# EAGLE schematic Controlador PID Analogico (EAGLE 7.6.0)
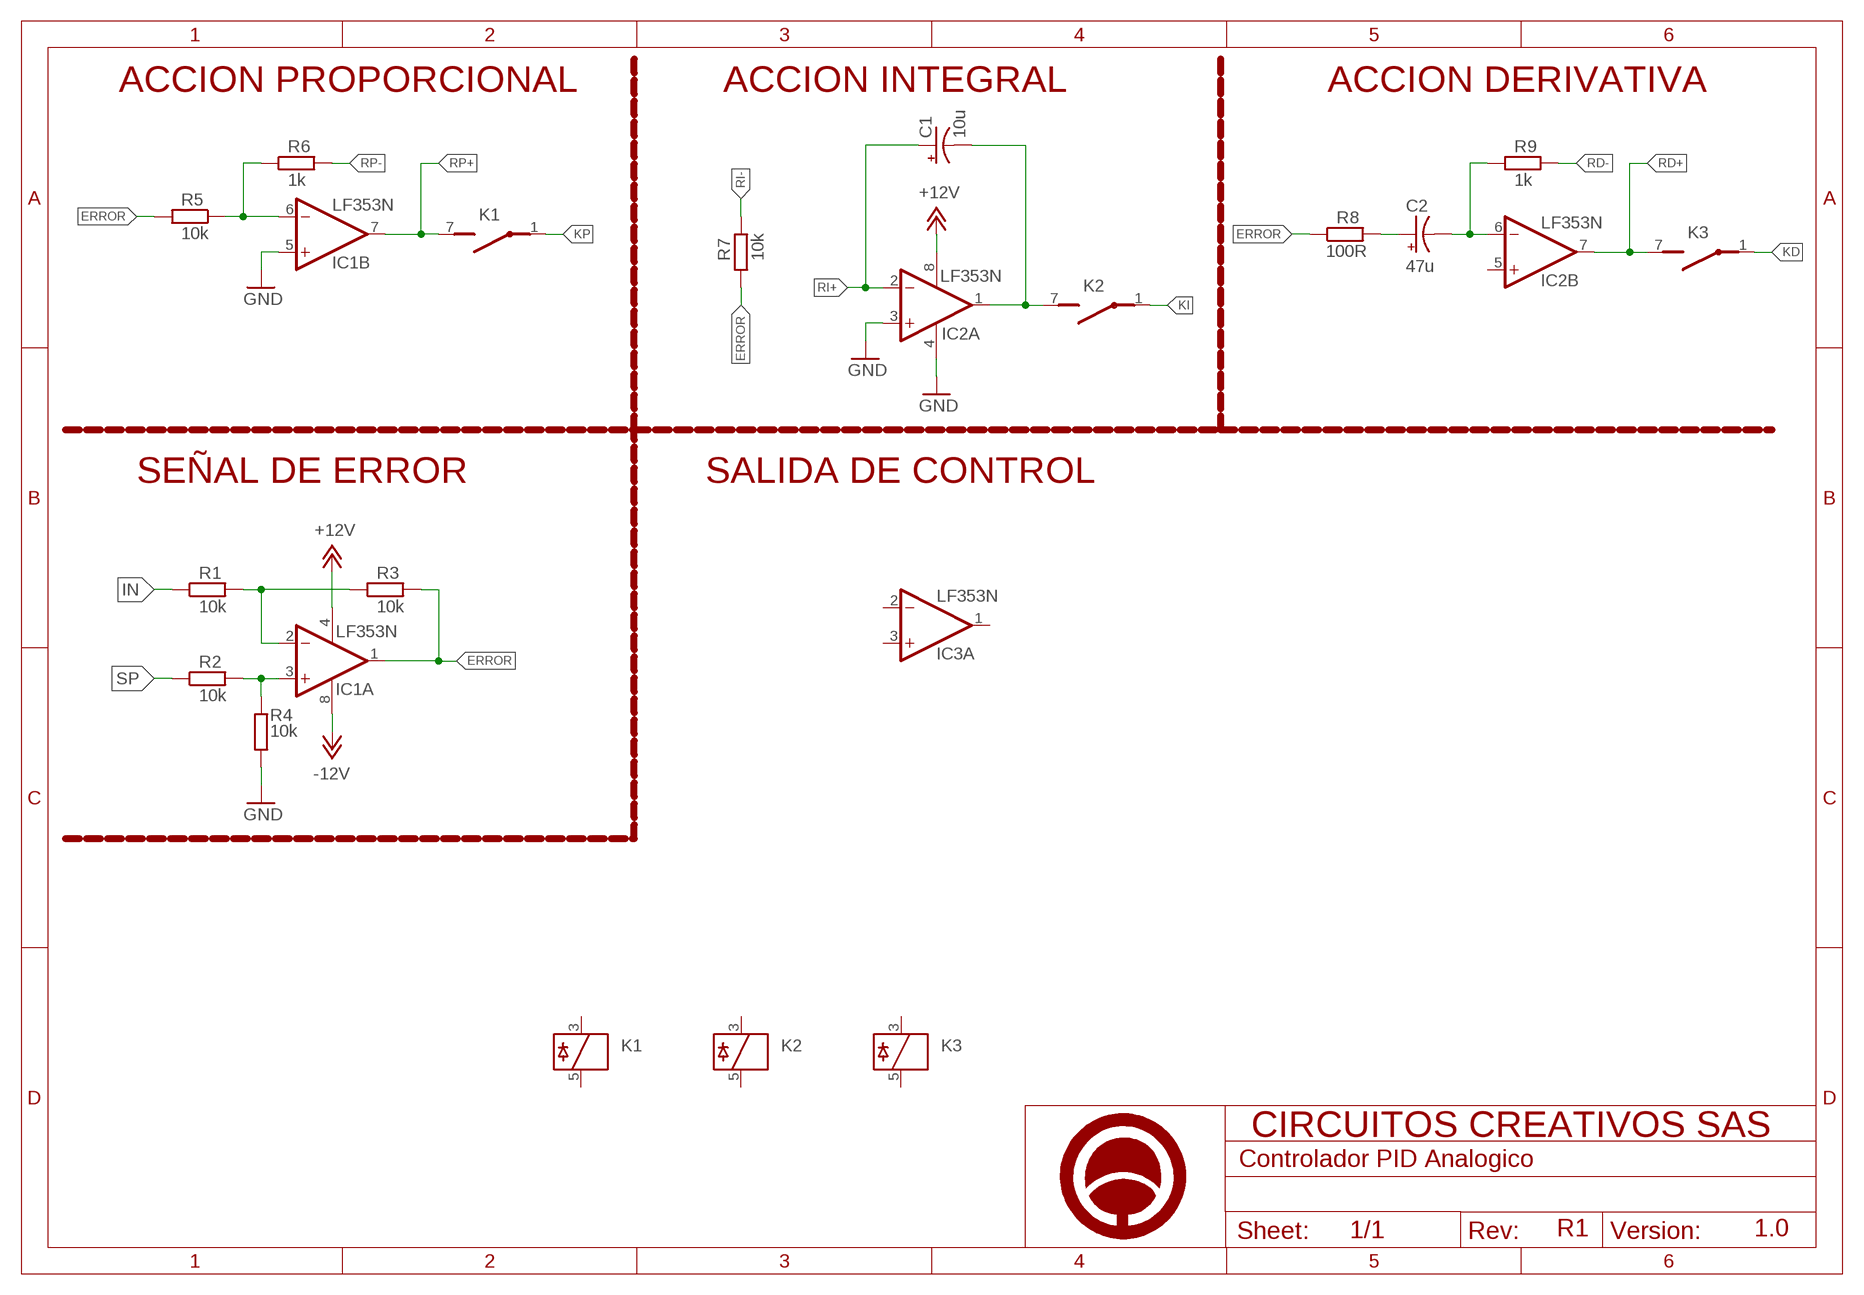
[diagram p0: schematic, sheet 1]

## Parts
C1  10u  CPOL-USE2,5-6E  [E2,5-6E]
C2  47u  CPOL-USE2,5-6E  [E2,5-6E]
IC1  LF353N  [DIL08]
IC2  LF353N  [DIL08]
IC3  LF353N  [DIL08]
K1  35701331  [REED]
K2  35701331  [REED]
K3  35701331  [REED]
R1  10k  R-EU_0204/7  [0204/7]
R2  10k  R-EU_0204/7  [0204/7]
R3  10k  R-EU_0204/7  [0204/7]
R4  10k  R-EU_0204/7  [0204/7]
R5  10k  R-EU_0204/7  [0204/7]
R6  1k  R-EU_0204/7  [0204/7]
R7  10k  R-EU_0204/7  [0204/7]
R8  100R  R-EU_0204/7  [0204/7]
R9  1k  R-EU_0204/7  [0204/7]
U$1  A4_HORIZONTAL  [LOGO]

## Nets
+12V: IC1.4(P:V-) IC2.8(P:V+)
-12V: IC1.8(P:V+)
ERROR: IC1.1(A:OUT) R3.2 R5.2 R7.2 R8.1
GND: IC1.5(B:+IN) IC2.3(A:+IN) IC2.4(P:V-) R4.2
IN: R1.1
KD: K3.1(2:P)
KI: K2.1(2:P)
KP: K1.1(2:P)
N$1: IC1.2(A:-IN) R1.2 R3.1
N$2: IC1.3(A:+IN) R2.2 R4.1
N$3: IC1.6(B:-IN) R5.1 R6.1
N$4: C1.- IC2.1(A:OUT) K2.7(2:S)
N$5: C2.- IC2.6(B:-IN) R9.1
N$6: C2.+ R8.2
RD+: IC2.7(B:OUT) K3.7(2:S)
RD-: R9.2
RI+: C1.+ IC2.2(A:-IN)
RI-: R7.1
RP+: IC1.7(B:OUT) K1.7(2:S)
RP-: R6.2
SP: R2.1
Unconnected: IC2.5(B:+IN) IC3.1(A:OUT) IC3.2(A:-IN) IC3.3(A:+IN) IC3.5(B:+IN) IC3.6(B:-IN) IC3.7(B:OUT) K1.3 K1.5 K2.3 K2.5 K3.3 K3.5

## Notes on the sheet
- ACCION PROPORCIONAL | ACCION INTEGRAL | ACCION DERIVATIVA
- SEÑAL DE ERROR | SALIDA DE CONTROL
- R1 | 1.0

## Power pins joined to a net without a drawn wire
V+: IC3.8(P:V+)
V-: IC3.4(P:V-)

## Library data of the parts
C1 C2 = rcl:CPOL-US: POLARIZED CAPACITOR, American symbol
IC1-IC3 = linear:LF353: OP AMP
K1-K3 = relay:35701331: RELAY reed, 1 x norm. open with polarity; OC_FARNELL: unknown; OC_NEWARK: unknown
R1-R9 = rcl:R-EU_: RESISTOR, European symbol
U$1 = Circuitos-Creativos-Estilos:A4_HORIZONTAL